# Altium schematic sheet LCD_Screen.SchDoc: LCD Touch Screen Display & Interaction
size A4; DocumentNumber: 14; SheetNumber: 14; SheetTotal: 16
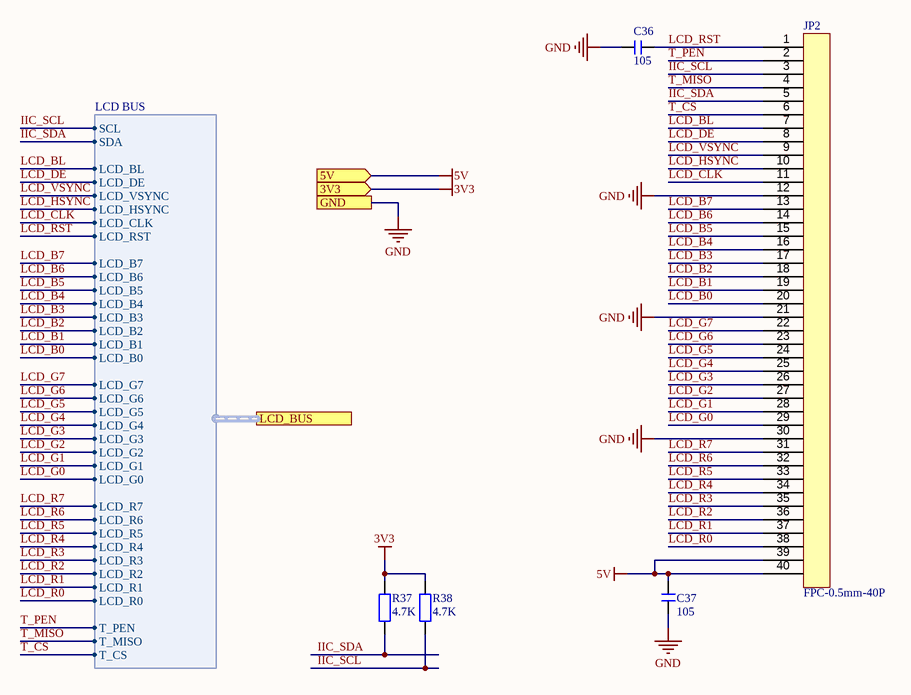
[diagram p0: LCD_Screen.SchDoc]

## Parts
C36  105  [C 0603_L]
C37  105  [C 0603_L]
JP2  FPC-0.5mm-40P  [FPC0.5 2H-WS-40P]
R37  4.7K  [R 0603_L]
R38  4.7K  [R 0603_L]

## Ports
3V3 (in), 5V (in), GND, LCD_BUS (harness LCD BUS)

## Harnesses
LCD BUS: SCL, SDA, LCD_R0, LCD_R1, LCD_R2, LCD_R3, LCD_R4, LCD_R5, LCD_R6, LCD_R7, LCD_G0, LCD_G1, LCD_G2, LCD_G3, LCD_G4, LCD_G5, LCD_G6, LCD_G7, LCD_B0, LCD_B1, LCD_B2, LCD_B3, LCD_B4, LCD_B5, LCD_B6, LCD_B7, LCD_RST, LCD_CLK, LCD_HSYNC, LCD_VSYNC, LCD_DE, LCD_BL, T_PEN, T_MISO, T_CS

## Nets
3V3: R37.2 R38.2 ; port 3V3
5V: C37.2 JP2.39 JP2.40 ; port 5V
GND: C36.2 C37.1 JP2.12 JP2.21 JP2.30 ; port GND
IIC_SCL: JP2.3 R38.1 ; port LCD_BUS.SCL
IIC_SDA: JP2.5 R37.1 ; port LCD_BUS.SDA
LCD_B0: JP2.20 ; port LCD_BUS.LCD_B0
LCD_B1: JP2.19 ; port LCD_BUS.LCD_B1
LCD_B2: JP2.18 ; port LCD_BUS.LCD_B2
LCD_B3: JP2.17 ; port LCD_BUS.LCD_B3
LCD_B4: JP2.16 ; port LCD_BUS.LCD_B4
LCD_B5: JP2.15 ; port LCD_BUS.LCD_B5
LCD_B6: JP2.14 ; port LCD_BUS.LCD_B6
LCD_B7: JP2.13 ; port LCD_BUS.LCD_B7
LCD_BL: JP2.7 ; port LCD_BUS.LCD_BL
LCD_CLK: JP2.11 ; port LCD_BUS.LCD_CLK
LCD_DE: JP2.8 ; port LCD_BUS.LCD_DE
LCD_G0: JP2.29 ; port LCD_BUS.LCD_G0
LCD_G1: JP2.28 ; port LCD_BUS.LCD_G1
LCD_G2: JP2.27 ; port LCD_BUS.LCD_G2
LCD_G3: JP2.26 ; port LCD_BUS.LCD_G3
LCD_G4: JP2.25 ; port LCD_BUS.LCD_G4
LCD_G5: JP2.24 ; port LCD_BUS.LCD_G5
LCD_G6: JP2.23 ; port LCD_BUS.LCD_G6
LCD_G7: JP2.22 ; port LCD_BUS.LCD_G7
LCD_HSYNC: JP2.10 ; port LCD_BUS.LCD_HSYNC
LCD_R0: JP2.38 ; port LCD_BUS.LCD_R0
LCD_R1: JP2.37 ; port LCD_BUS.LCD_R1
LCD_R2: JP2.36 ; port LCD_BUS.LCD_R2
LCD_R3: JP2.35 ; port LCD_BUS.LCD_R3
LCD_R4: JP2.34 ; port LCD_BUS.LCD_R4
LCD_R5: JP2.33 ; port LCD_BUS.LCD_R5
LCD_R6: JP2.32 ; port LCD_BUS.LCD_R6
LCD_R7: JP2.31 ; port LCD_BUS.LCD_R7
LCD_RST: C36.1 JP2.1 ; port LCD_BUS.LCD_RST
LCD_VSYNC: JP2.9 ; port LCD_BUS.LCD_VSYNC
T_CS: JP2.6 ; port LCD_BUS.T_CS
T_MISO: JP2.4 ; port LCD_BUS.T_MISO
T_PEN: JP2.2 ; port LCD_BUS.T_PEN

## Notes on the sheet
- Title
- FileName:
- Version:
- Date:
- Project
- Designed By:
- Descriptions:
- Sheet:
- of

## Library data of the parts
C36 C37 = C: 贴片电容; BOM名称: 无极性贴片电容; 淘宝ID: 封装库来自淘宝 ID：黄晶宝石; 联系售后，技术支持: https://shop463601444.taobao.com; 唯一出售店铺网址: https://shop463601444.taobao.com
JP2 = FPC-0.5mm-40P: FPC Connector 0.5mm 40PIN
R37 R38 = R: 贴片电阻; 版权归属: 来自淘宝 ID：黄晶宝石; 封装库来自淘宝卖家 ID：黄晶宝石: 其他店铺购入均为盗版，不享受售后技术支持服务，请立即申请退款; BOM名称: 贴片电阻; 联系售后: https://shop463601444.taobao.com